# Altium project Kandityö_pcb.PrjPcb
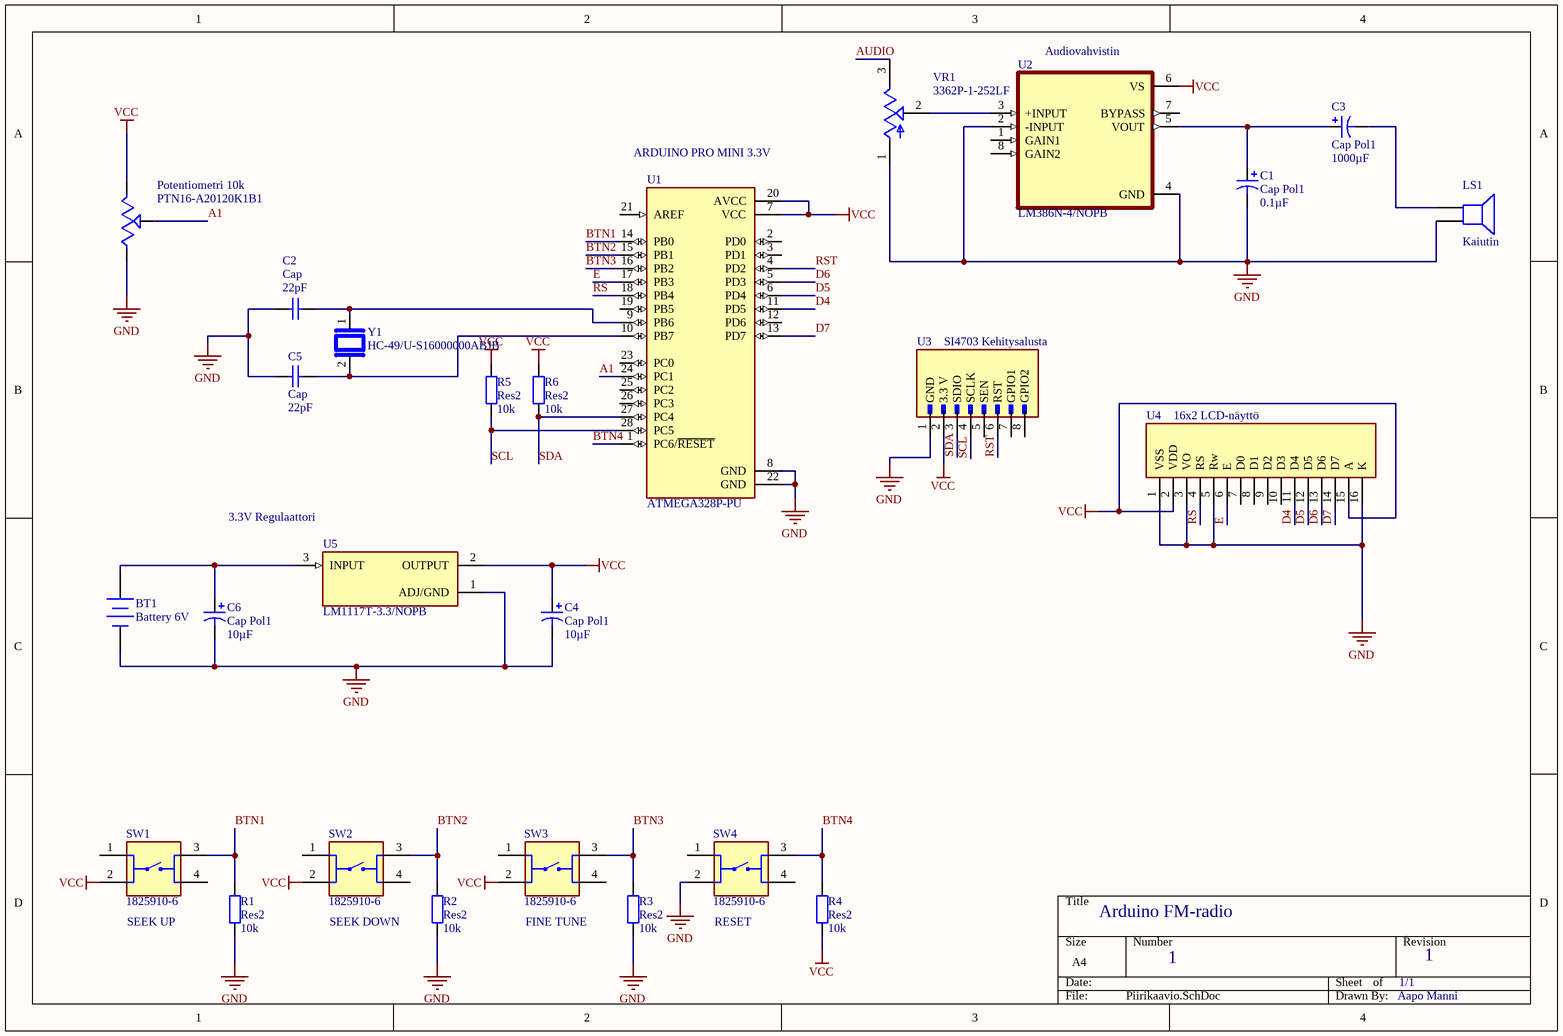
[diagram p0: Piirikaavio.SchDoc]
1 sheet, 26 parts. Net scope: global (net labels, ports and power ports of the same name join across sheets).
Board files: pcb_v1.PcbDoc, PCB_v2.PcbDoc

## Sheet Piirikaavio.SchDoc: Arduino FM-radio
size A4; DrawnBy: Aapo Manni; Organization: Altium Limited; Address1: L3, 12a Rodborough Rd; Address2: Frenchs Forest; Address3: NSW; Address4: Australia 2086; SheetNumber: 1

### Parts
BT1  Battery 6V  [BAT-2]
C1  Cap Pol1  value 0.1µF  [RB7.6-15]
C2  Cap  value 22pF  [RAD-0.3]
C3  Cap Pol1  value 1000µF  [RB7.6-15]
C4  Cap Pol1  value 10µF  [RB7.6-15]
C5  Cap  value 22pF  [RAD-0.3]
C6  Cap Pol1  value 10µF  [RB7.6-15]
LS1  Kaiutin  [PIN2]
Potentiometri_10k  PTN16-A20120K1B1  [POT_PTN16-A20120K1B1]
R1  Res2  value 10k  [AXIAL-0.4]
R2  Res2  value 10k  [AXIAL-0.4]
R3  Res2  value 10k  [AXIAL-0.4]
R4  Res2  value 10k  [AXIAL-0.4]
R5  Res2  value 10k  [AXIAL-0.4]
R6  Res2  value 10k  [AXIAL-0.4]
SW1  1825910-6  [SW_1825910-6-4]
SW2  1825910-6  [SW_1825910-6-4]
SW3  1825910-6  [SW_1825910-6-4]
SW4  1825910-6  [SW_1825910-6-4]
U1  ATMEGA328P-PU  [DIP794W46P254L2967H457Q28B]
U2  LM386N-4/NOPB  [DIP794W45P254L959H508Q8]
U3  SI4703 Kehitysalusta  [HARWIN_M20-9730846]
U4  16x2 LCD-näyttö  [TE_6-146276-6]
U5  LM1117T-3.3/NOPB  [TO254P1054X470X1955-3]
VR1  3362P-1-252LF  [TRIM_3362P-1-252LF]
Y1  HC-49/U-S16000000ABJB  [XTAL_HC49P488W43L1150T466H350]

### Nets
GND: BT1.2(-) C1.2 C2.1 C4.2 C5.1 C6.2 LS1.2 Potentiometri_10k.1 R1.2 R2.2 R3.2 SW4.2 U1.8(GND) U1.22(GND) U2.2(-INPUT) U2.4(GND) U3.1(GND) U4.1(VSS) U4.3(VO) U4.5(Rw) U4.16(K) U5.1(ADJ/GND) VR1.1(CCW)
VCC: C4.1 Potentiometri_10k.3 R4.2 R5.1 R6.1 SW1.2 SW2.2 SW3.2 U1.7(VCC) U1.20(AVCC) U2.6(VS) U3.2(3.3_V) U4.2(VDD) U4.15(A) U5.2(OUTPUT)
A1: Potentiometri_10k.2 U1.24(PC1)
AUDIO: VR1.3(CW)
BTN1: R1.1 SW1.3 U1.14(PB0)
BTN2: R2.1 SW2.3 U1.15(PB1)
BTN3: R3.1 SW3.3 U1.16(PB2)
BTN4: R4.1 SW4.3 U1.1(PC6/~{RESET})
D4: U1.11(PD5) U4.11(D4)
D5: U1.6(PD4) U4.12(D5)
D6: U1.5(PD3) U4.13(D6)
D7: U1.13(PD7) U4.14(D7)
E: U1.17(PB3) U4.6(E)
RS: U1.18(PB4) U4.4(RS)
RST: U1.4(PD2) U3.6(RST)
SCL: R5.2 U1.28(PC5) U3.4(SCLK)
SDA: R6.2 U1.27(PC4) U3.3(SDIO)
NetBT1_1: BT1.1(+) C6.1 U5.3(INPUT)
NetC1_1: C1.1 C3.1 U2.5(VOUT)
NetC2_2: C2.2 U1.9(PB6) Y1.1
NetC3_2: C3.2 LS1.1
NetC5_2: C5.2 U1.10(PB7) Y1.2
NetU2_3: U2.3(+INPUT) VR1.2(WIPER)

Not connected (* = marked no-connect by the designer): SW1 1 4; SW2 1 4; SW3 1 4; SW4 1 4; U1 2(PD0) 3(PD1) 12(PD6) 19(PB5) 21(AREF) 23(PC0) 25(PC2) 26(PC3); U2 1(GAIN1) 7(BYPASS) 8(GAIN2); U3 5(SEN) 7(GPIO1) 8(GPIO2); U4 7(D0) 8(D1) 9(D2) 10(D3)

### Notes on the sheet
- (near U2) Audiovahvistin
- (near U1) ARDUINO PRO MINI 3.3V
- (near U5) 3.3V Regulaattori
- (near SW1) SEEK UP
- SEEK DOWN
- FINE TUNE
- (near SW4) RESET
- 1/1
- 1
- Title
- Size:
- Date:
- A4
- Number:
- Time:
- Revision:
- Sheet
- of
- File:

### Library data of the parts
BT1 = Battery: Multicell Battery; Published: 24-Mar-1999; LatestRevisionDate: 17-Jul-2002; LatestRevisionNote: Re-released for DXP Platform.; PackageReference: BAT-2; Publisher: Altium Limited; PackageDescription: Battery; 2 Leads
C1 C3 C4 C6 = Cap Pol1: Polarized Capacitor (Radial); Published: 8-Jun-2000; LatestRevisionDate: 17-Jul-2002; LatestRevisionNote: Re-released for DXP Platform.; PackageReference: RB7.6-15; Publisher: Altium Limited; PackageDescription: Polarized Capacitor (Radial); 2 Leads
C2 C5 = Cap: Capacitor; Published: 8-Jun-2000; LatestRevisionDate: 17-Jul-2002; LatestRevisionNote: Re-released for DXP Platform.; PackageReference: RAD-0.3; Publisher: Altium Limited; PackageDescription: Radial Cap, Thru-Hole; 2 Leads; 0.3 in Pin Spacing
LS1 = Speaker: Loudspeaker; Published: 24-Mar-1999; LatestRevisionDate: 17-Jul-2002; LatestRevisionNote: Re-released for DXP Platform.; PackageReference: PIN2; Publisher: Altium Limited
Potentiometri_10k = PTN16-A20120K1B1: 16.5 mm, Horizontal, Linear, 20 kÎ©, Through Hole, Knurled Shaft Single Section Rotary Potentiometer; MF: CUI Devices; SnapEDA_Link: https://www.snapeda.com/parts/PTN16-A20120K1B1/CUI+Devices/view-part/?ref=snap; Package: None; Value: *; CUI_purchase_URL: https://www.cuidevices.com/product/motion-and-control/potentiometers/rotary-potentiometers/ptn16-a20120k1b1?utm_source=snapeda.com&utm_medium=referral&utm_campaign=snapedaBOM; MP: PTN16-A20120K1B1; Check_prices: https://www.snapeda.com/parts/PTN16-A20120K1B1/CUI+Devices/view-part/?ref=eda
R1-R6 = Res2: Resistor 10k; Published: 8-Jun-2000; LatestRevisionDate: 17-Jul-2002; LatestRevisionNote: Re-released for DXP Platform.; PackageReference: AXIAL-0.4; Publisher: Altium Limited; PackageDescription: Axial Device, Thru-Hole; 2 Leads; 0.4 in Pin Spacing
SW1-SW4 = 1825910-6: Switch Push Button OFF (ON) SPST Round Button 0.05A 24VDC Momentary Contact PC Pins Thru-Hole; MF: TE Connectivity; Value: *; MP: 1825910-6; Package: None; Check_prices: https://www.snapeda.com/parts/1825910-6/TE+Connectivity+ALCOSWITCH+Switches/view-part/?ref=eda; SnapEDA_Link: https://www.snapeda.com/parts/1825910-6/TE+Connectivity+ALCOSWITCH+Switches/view-part/?ref=snap; Digi-Key_Part_Number: 450-1650-ND; Purchase-URL: https://pricing.snapeda.com/search/part/1825910-6/?ref=eda
U1 = ATMEGA328P-PU: ATmega Series 20 MHz 32 KB Flash 2 KB SRAM 8-Bit Microcontroller - DIP-28; MP: ATMEGA328P-PU; Package: None; Availability: Unavailable; Price: None; Value: *
U2 = LM386N-4/NOPB: LM386 Low Voltage Audio Power Amplifier; Value: *; MP: LM386N-4/NOPB; Package: None; Availability: Unavailable; Price: None
U3 = M20-9730846: Si4703 Evaluation board; MF: Harwin; Package: None; Price: None; Value: *; MP: M20-9730846; Availability: Unavailable
U4 = 6-146276-6: 16x2 Character LCD Module; Centerline_Pitch: 2.54 mm[.1 in]; Number_of_Positions: 16; Product_Type: Connector; MF: TE Connectivity; SnapEDA_Link: https://www.snapeda.com/parts/6-146276-6/TE%20Connectivity/view-part/1438677/?ref=snap; Price: None; Purchase-URL: https://pricing.snapeda.com/search/part/6-146276-6/?ref=eda; Value: *; MP: 6-146276-6; Package: None; EU_RoHS_Compliance: Compliant; Availability: Warning; Check_prices: https://www.snapeda.com/parts/6-146276-6/TE%20Connectivity/view-part/1438677/?ref=eda
U5 = LM1117T-3.3/NOPB: 800-mA 15-V linear voltage regulator; MF: Texas Instruments; Package: TO-220-3 Texas Instruments; Price: None; Check_prices: https://www.snapeda.com/parts/LM1117T-3.3/NOPB/Texas+Instruments/view-part/?ref=eda; Value: *; SnapEDA_Link: https://www.snapeda.com/parts/LM1117T-3.3/NOPB/Texas+Instruments/view-part/?ref=snap; MP: LM1117T-3.3/NOPB; Availability: In Stock; Purchase-URL: https://pricing.snapeda.com/search/part/LM1117T-3.3/NOPB/?ref=eda
VR1 = 3362P-1-252LF: 10 kOhms Pins Through Hole Trimmer Potentiometer Cermet 1 Turn Top Adjustment; MF: Bourns; Check_prices: https://www.snapeda.com/parts/3362P-1-252LF/Bourns/view-part/1439689/?ref=eda; Purchase-URL: https://pricing.snapeda.com/search/part/3362P-1-252LF/?ref=eda; Price: None; SnapEDA_Link: https://www.snapeda.com/parts/3362P-1-252LF/Bourns/view-part/1439689/?ref=snap; Availability: Warning; Package: 3362P-1 Bourns Inc.; MP: 3362P-1-252LF; Value: *
Y1 = HC-49/U-S16000000ABJB: 8 MHz Crystal  / HC-49/US; MF: Citizen Finedevice; SnapEDA_Link: https://www.snapeda.com/parts/HC-49/U-S16000000ABJB/Citizen/view-part/?ref=snap; Package: HC-49/US Citizen Finetech Miyota; Value: *; MP: HC-49/U-S16000000ABJB; Check_prices: https://www.snapeda.com/parts/HC-49/U-S16000000ABJB/Citizen/view-part/?ref=eda